# Altium project Fast_Servo.PrjPCB (part 4 of 7)

## Sheet CON_MEZZANINE_ANALOG.SchDoc: Mezzanine con analog
size 420 x 297 mm; Author: G.Kasprowicz; CompanyName: WUT ISE; DrawnBy: G.Kasprowicz; Organization: WUT ISE; Address1: PW ISE; Address2: Nowowiejska 15/19 00-665 Warsaw; Address3: gkasprow@gmail.com; DocumentNumber: 21; Revision: 1.0; SheetNumber: 21; SheetTotal: 37; ModifiedBy: -; CheckedDate: -; DivGrp: WUT ISE; Designer: G.Kasprowicz; Title2: Fast Stabilizer; ModifiedDate: -; ProjectName: Sensor Box
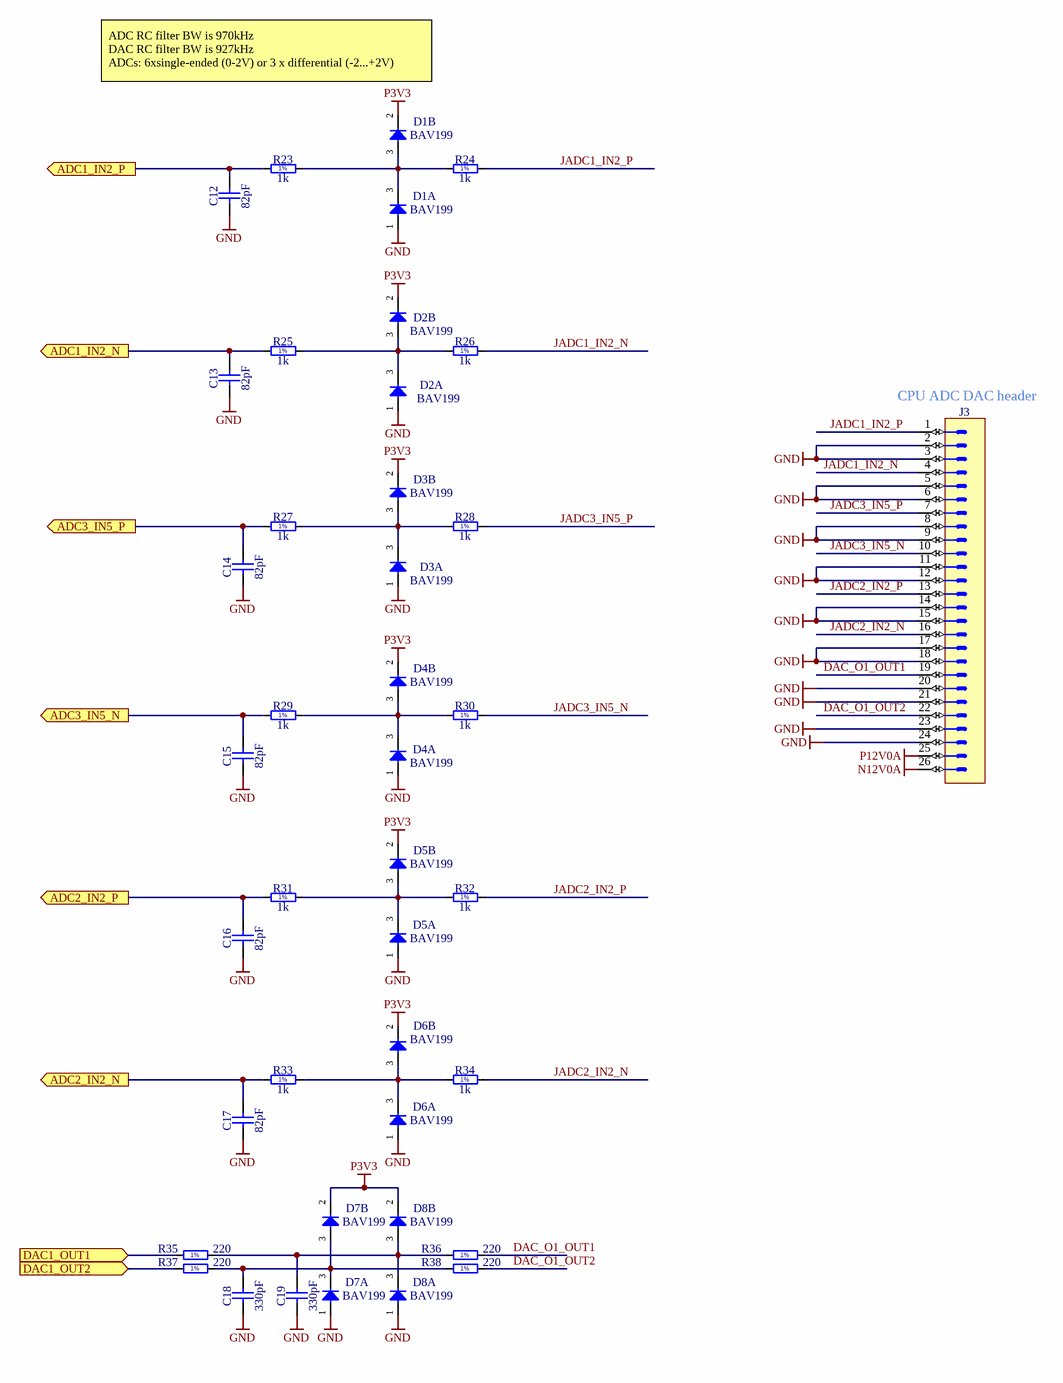
[diagram p14: CON_MEZZANINE_ANALOG.SchDoc]

### Parts
C12  82pF  [CAPC1608X87N]
C13  82pF  [CAPC1608X87N]
C14  82pF  [CAPC1608X87N]
C15  82pF  [CAPC1608X87N]
C16  82pF  [CAPC1608X87N]
C17  82pF  [CAPC1608X87N]
C18  330pF  [CAPC1608X87N]
C19  330pF  [CAPC1608X87N]
D1  BAV199  [SOT95P240X110-3N]  (parts A,B of 2)
D2  BAV199  [SOT95P240X110-3N]  (parts A,B of 2)
D3  BAV199  [SOT95P240X110-3N]  (parts A,B of 2)
D4  BAV199  [SOT95P240X110-3N]  (parts A,B of 2)
D5  BAV199  [SOT95P240X110-3N]  (parts A,B of 2)
D6  BAV199  [SOT95P240X110-3N]  (parts A,B of 2)
D7  BAV199  [SOT95P240X110-3N]  (parts A,B of 2)
D8  BAV199  [SOT95P240X110-3N]  (parts A,B of 2)
J3  Header 26  [3M_N2526-6002RB]  (value not drawn)
R23  1k  [RESC1005X40N]
R24  1k  [RESC1005X40N]
R25  1k  [RESC1005X40N]
R26  1k  [RESC1005X40N]
R27  1k  [RESC1005X40N]
R28  1k  [RESC1005X40N]
R29  1k  [RESC1005X40N]
R30  1k  [RESC1005X40N]
R31  1k  [RESC1005X40N]
R32  1k  [RESC1005X40N]
R33  1k  [RESC1005X40N]
R34  1k  [RESC1005X40N]
R35  220  [RESC1608X55N]
R36  220  [RESC1608X55N]
R37  220  [RESC1608X55N]
R38  220  [RESC1608X55N]

### Ports
ADC1_IN2_N (out), ADC1_IN2_P (out), ADC2_IN2_N (out), ADC2_IN2_P (out), ADC3_IN5_N (out), ADC3_IN5_P (out), DAC1_OUT1 (in), DAC1_OUT2 (in)

### Nets
GND: C12.1 C13.1 C14.1 C15.1 C16.1 C17.1 C18.1 C19.1 D1.1(A) D2.1(A) D3.1(A) D4.1(A) D5.1(A) D6.1(A) D7.1(A) D8.1(A) J3.2 J3.3 J3.5 J3.6 J3.8 J3.9 J3.11 J3.12 J3.14 J3.15 J3.17 J3.18 J3.20 J3.21 J3.23 J3.24
N12V0A: J3.26
P3V3: D1.2(C) D2.2(C) D3.2(C) D4.2(C) D5.2(C) D6.2(C) D7.2(C) D8.2(C)
P12V0A: J3.25
ADC_AUX_CH1_N: C13.2 R25.1 ; port ADC1_IN2_N
ADC_AUX_CH1_P: C12.2 R23.1 ; port ADC1_IN2_P
ADC_AUX_CH2_N: C17.2 R33.1 ; port ADC2_IN2_N
ADC_AUX_CH2_P: C16.2 R31.1 ; port ADC2_IN2_P
ADC_AUX_CH3_N: C15.2 R29.1 ; port ADC3_IN5_N
ADC_AUX_CH3_P: C14.2 R27.1 ; port ADC3_IN5_P
DAC_O1_OUT1: J3.19 R36.2
DAC_O1_OUT2: J3.22 R38.2
JADC1_IN2_N: J3.4 R26.2
JADC1_IN2_P: J3.1 R24.2
JADC2_IN2_N: J3.16 R34.2
JADC2_IN2_P: J3.13 R32.2
JADC3_IN5_N: J3.10 R30.2
JADC3_IN5_P: J3.7 R28.2
VOUTA: R35.1 ; port DAC1_OUT1
VOUTB: R37.1 ; port DAC1_OUT2
NetC18_2: C18.2 D7.3(COMAC) R37.2 R38.1
NetC19_2: C19.2 D8.3(COMAC) R35.2 R36.1
NetD1_3: D1.3(COMAC) R23.2 R24.1
NetD2_3: D2.3(COMAC) R25.2 R26.1
NetD3_3: D3.3(COMAC) R27.2 R28.1
NetD4_3: D4.3(COMAC) R29.2 R30.1
NetD5_3: D5.3(COMAC) R31.2 R32.1
NetD6_3: D6.3(COMAC) R33.2 R34.1

### Notes on the sheet
- (near D1) ADC RC filter BW is 970kHz
  DAC RC filter BW is 927kHz
  ADCs: 6xsingle-ended (0-2V) or 3 x differential (-2...+2V)
- (near J3) CPU ADC DAC header
- Project/Equipment
- Document
- Designer
- Drawn by
- Check.by
- Copyright WUT ISE 2020.
  This documentation describes Open Hardware and is licensed under the CERN OHL v.1.2. You may redistribute and modify this documentation under the terms of the CERN OHL v.1.2. (http://ohwr.org/CERNOHL). This documentation is distributed WITHOUT ANY EXPRESS OR IMPLIED WARRANTY, INCLUDING OF MERCHANTABILITY, SATISFACTORY QUALITY AND FITNESS FOR A PARTICULAR PURPOSE. Please see the CERN OHL v.1.2 for applicable conditions.
- Contact
- File
- Last Mod.
- Print Date
- Sheet
- Size
- A3
- of
- Rev
- (in symbol R0402_1K_1%_0.0625W_100PPM) 1%
- (in symbol R0603_220R_1%_0.1W_100PPM) 1%

### Library data of the parts
C12-C17 = CC0603_82PF_50V_5%_NP0: Non-polarised capacitor; Part Description: SMD Multilayer Chip Ceramic Capacitor; Manufacturer: GENERIC; Manufacturer1 Part Number: 223886715829; Voltage: 50V; TC: C0G/NP0; Tolerance: ±5%; Part Number: CC0603_82PF_50V_5%_NP0; Component Kind: Standard; Component Type: Standard; Pin Count: 2; Value: 82pF; Status: Preferred; Manufacturer Part Number: CC0603_82PF_50V_5%_NP0; Case: 0603; Mounted: Yes; Socket: No; SMD: Yes; Sense: No; Manufacturer1 Example: PHYCOMP; Manufacturer1 ComponentHeight: 0.87mm; HelpURL: \\cern.ch\dfs\Applications\Altium\Datasheets\CC0603_NP0_PHYCOMP.pdf; Author: CERN DEM JLC; CreateDate: 03.12.2007; LatestRevisionDate: 03.12.2007
C18 C19 = CC0603_330PF_50V_1%_NP0: Non-polarised capacitor; Part Description: SMD Multilayer Chip Ceramic Capacitor; Manufacturer: GENERIC; Manufacturer1 Part Number: 223886718331; Voltage: 50V; TC: C0G/NP0; Tolerance: ±1%; Part Number: CC0603_330PF_50V_1%_NP0; Component Kind: Standard; Component Type: Standard; Pin Count: 2; Value: 330pF; Status: None; Manufacturer Part Number: CC0603_330PF_50V_1%_NP0; Case: 0603; Mounted: Yes; Socket: No; SMD: Yes; Sense: No; Manufacturer1 Example: PHYCOMP; Manufacturer1 ComponentHeight: 0.87mm; HelpURL: \\cern.ch\dfs\Applications\Altium\Datasheets\CC0603_NP0_PHYCOMP.pdf; Author: CERN DEM MR; CreateDate: 06.09.2017; LatestRevisionDate: 06.09.2017
D1-D8 = BAV199: Serial Diode; Part Description: Low-Leakage Double Diode; Manufacturer: NXP SEMICONDUCTORS; Voltage: 75V; Power: 250mW; PressFit: No; Bonding: No; Part Number: BAV199; Component Kind: Standard; Component Type: Standard; Device: BAV199; PackageDescription: SOT23 3-Leads, Pitch 0.95mm - Body 1.4x3mm, IPC Medium Density; Manufacturer Part Number: BAV199; Pin Count: 3; Case: SOT23-3; Mounted: Yes; Socket: No; SMD: Yes; Sense: No; ComponentHeight: 1.1mm; HelpURL: \\cern.ch\dfs\Applications\Altium\Datasheets\BAV199.pdf; Author: CERN DEM JMW; CreateDate: 2008-11-21; LatestRevisionDate: 2008-11-21
J3 = 3M_N2526-6002RB: Connector 26 Male; Part Description: 26 Contacts - Straight .100'' x .100'' Low Profile Four-Wall Header, 2500 Series; Manufacturer: 3M; PressFit: No; Part Number: 3M_N2526-6002RB; Component Kind: Standard; Component Type: Standard; Pin Count: 26; Family: Header 26; Mounted: Yes; Socket: No; SMD: No; Sense: No; Status: None; Manufacturer Part Number: N2526-6002RB; ComponentHeight: 10.03mm; HelpURL: \\cern.ch\dfs\Applications\Altium\Datasheets\3M_N2526-6002RB.pdf; Author: CERN DEM JLC; CreateDate: 11.02.2009; LatestRevisionDate: 11.08.2009
R23-R34 = R0402_1K_1%_0.0625W_100PPM: as R133 on sheet EEPROM_Sensors; Part Number: R0402_1K_1%_0.0625W_100PPM; Component Kind: Standard; Component Type: Standard; Pin Count: 2; Value: 1k; Status: Not Recommended; Power: 0.0625W; Tolerance: ±1%; Manufacturer Part Number: R0402_1K_1%_0.0625W_100PPM; Case: 0402; Mounted: Yes; Sense: No; Socket: No; SMD: Yes; Manufacturer1 Example: YAGEO PHYCOMP; Manufacturer1 ComponentHeight: 0.4mm; HelpURL: \\cern.ch\dfs\Applications\Altium\Datasheets\R0402_Phycomp_RC0402.pdf; Author: CERN DEM JLC; CreateDate: 03/12/2007; LatestRevisionDate: 17/10/2012
R35-R38 = R0603_220R_1%_0.1W_100PPM: Resistor - 1%; Part Description: General Purpose Thick Film Chip Resistor; Manufacturer: GENERIC; Manufacturer1 Part Number: NRC06F2200TRF; Power: 0.1W; TC: ±100ppm/°C; PressFit: No; Part Number: R0603_220R_1%_0.1W_100PPM; Component Kind: Standard; Component Type: Standard; Pin Count: 2; Value: 220; Status: Preferred; Tolerance: ±1%; Manufacturer Part Number: R0603_220R_1%_0.1W_100PPM; Case: 0603; Mounted: Yes; Sense: No; Socket: No; SMD: Yes; Manufacturer1 Example: NIC COMPONENT; Manufacturer1 ComponentHeight: 0.55mm; HelpURL: \\cern.ch\dfs\Applications\Altium\Datasheets\R0603_NIC_NRC.pdf; Author: CERN DEM JLC; CreateDate: 03/12/2007; LatestRevisionDate: 13/03/2008

## Sheet ADC_AUX.SchDoc: Auxillary ADC
size 420 x 297 mm; Author: P. Zdunek; DrawnBy: P. Zdunek; Organization: Altium Limited; Address1: L3, 12a Rodborough Rd; Address2: Frenchs Forest; Address3: NSW; Address4: Australia 2086; DocumentNumber: 10; SheetNumber: 10; SheetTotal: 37; ModifiedBy: -; CheckedDate: -; Title2: Fast Stabilizer; DivGrp: WUT ISE; Designer: G.Kasprowicz
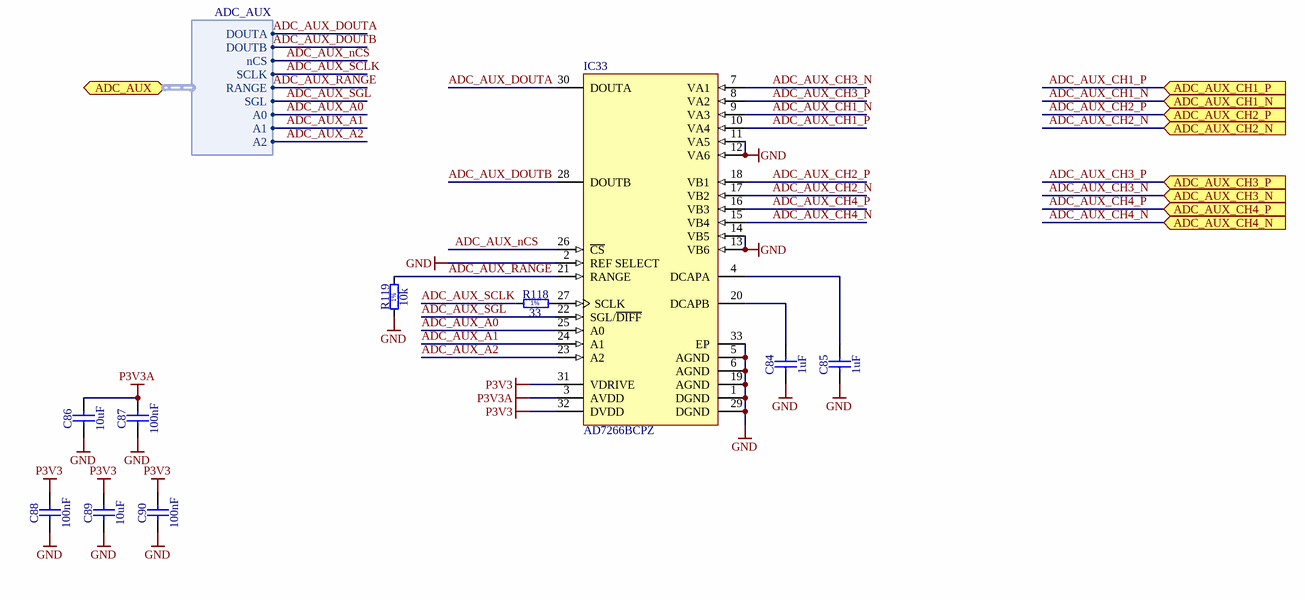
[diagram p15: ADC_AUX.SchDoc]

### Parts
C84  1uF  [CAPC1005X55N]
C85  1uF  [CAPC1005X55N]
C86  10uF  [CAPC1608X80N]
C87  100nF  [CAPC1005X55N]
C88  100nF  [CAPC1005X55N]
C89  10uF  [CAPC1608X80N]
C90  100nF  [CAPC1005X55N]
IC33  AD7266BCPZ  [CP-32-2_N]
R118  33  [RESC1005X40N]
R119  10k  [RESC1005X40N]

### Ports
ADC_AUX (bidir, harness ADC_AUX), ADC_AUX_CH1_N (in), ADC_AUX_CH1_P (in), ADC_AUX_CH2_N (in), ADC_AUX_CH2_P (in), ADC_AUX_CH3_N (in), ADC_AUX_CH3_P (in), ADC_AUX_CH4_N (in), ADC_AUX_CH4_P (in)

### Harnesses
ADC_AUX: DOUTA, DOUTB, nCS, RANGE, SCLK, SGL, A0, A1, A2

### Nets
GND: C84.1 C85.1 C86.1 C87.1 C88.1 C89.1 C90.1 IC33.1(DGND) IC33.2(REF_SELECT) IC33.5(AGND) IC33.6(AGND) IC33.11(VA5) IC33.12(VA6) IC33.13(VB6) IC33.14(VB5) IC33.19(AGND) IC33.29(DGND) IC33.33(EP) R119.1
P3V3: C88.2 C89.2 C90.2 IC33.31(VDRIVE) IC33.32(DVDD)
P3V3A: C86.2 C87.2 IC33.3(AVDD)
ADC_AUX_A0: IC33.25(A0) ; port ADC_AUX.A0
ADC_AUX_A1: IC33.24(A1) ; port ADC_AUX.A1
ADC_AUX_A2: IC33.23(A2) ; port ADC_AUX.A2
ADC_AUX_CH1_N: IC33.9(VA3) ; port ADC_AUX_CH1_N
ADC_AUX_CH1_P: IC33.10(VA4) ; port ADC_AUX_CH1_P
ADC_AUX_CH2_N: IC33.17(VB2) ; port ADC_AUX_CH2_N
ADC_AUX_CH2_P: IC33.18(VB1) ; port ADC_AUX_CH2_P
ADC_AUX_CH3_N: IC33.7(VA1) ; port ADC_AUX_CH3_N
ADC_AUX_CH3_P: IC33.8(VA2) ; port ADC_AUX_CH3_P
ADC_AUX_CH4_N: IC33.15(VB4) ; port ADC_AUX_CH4_N  [project net ADC_AUX_N]
ADC_AUX_CH4_P: IC33.16(VB3) ; port ADC_AUX_CH4_P  [project net ADC_AUX_P]
ADC_AUX_DOUTA: IC33.30(DOUTA) ; port ADC_AUX.DOUTA
ADC_AUX_DOUTB: IC33.28(DOUTB) ; port ADC_AUX.DOUTB
ADC_AUX_nCS: IC33.26(~{CS}) ; port ADC_AUX.nCS
ADC_AUX_RANGE: IC33.21(RANGE) R119.2 ; port ADC_AUX.RANGE
ADC_AUX_SCLK: R118.1 ; port ADC_AUX.SCLK
ADC_AUX_SGL: IC33.22(SGL/~{DIFF}) ; port ADC_AUX.SGL
NetC84_2: C84.2 IC33.20(DCAPB)
NetC85_2: C85.2 IC33.4(DCAPA)
NetIC33_27: IC33.27(SCLK) R118.2

### Notes on the sheet
- Project/Equipment
- Document
- Designer
- Drawn by
- Check.by
- Copyright WUT ISE 2020.
  This documentation describes Open Hardware and is licensed under the CERN OHL v.1.2. You may redistribute and modify this documentation under the terms of the CERN OHL v.1.2. (http://ohwr.org/CERNOHL). This documentation is distributed WITHOUT ANY EXPRESS OR IMPLIED WARRANTY, INCLUDING OF MERCHANTABILITY, SATISFACTORY QUALITY AND FITNESS FOR A PARTICULAR PURPOSE. Please see the CERN OHL v.1.2 for applicable conditions.
- Contact
- File
- Last Mod.
- Print Date
- Sheet
- Size
- A3
- of
- Rev
- (in symbol R0402_10K_1%_0.0625W_100PPM) 1%
- (in symbol R0402_33R_1%_0.0625W_100PPM) 1%

### Library data of the parts
C84 C85 = CC0402_1UF_16V_10%_X5R: Non-polarised capacitor; Part Description: SMD Multilayer Chip Ceramic Capacitor; Manufacturer: GENERIC; Manufacturer1 Part Number: C1005X5R1C105KT; Voltage: 16V; TC: X5R; Tolerance: ±10%; Part Number: CC0402_1UF_16V_10%_X5R; Component Kind: Standard; Component Type: Standard; Pin Count: 2; Value: 1uF; Status: Preferred; Manufacturer Part Number: CC0402_1UF_16V_10%_X5R; Case: 0402; Mounted: Yes; Socket: No; SMD: Yes; Sense: No; Manufacturer1 Example: TDK; Manufacturer1 ComponentHeight: 0.55mm; HelpURL: \\cern.ch\dfs\Applications\Altium\Datasheets\CC0402_X5R_TDK_C.pdf; Author: CERN DEM JLC; CreateDate: 25.10.2012; LatestRevisionDate: 25.10.2012
C86 C89 = CC0603_10UF_10V_10%_X5R: Non-polarised capacitor; Part Description: SMD Multilayer Chip Ceramic Capacitor; Manufacturer: GENERIC; Manufacturer1 Part Number: GRM188R61A106KE69D; Voltage: 10V; TC: X5R; Tolerance: ±10%; Part Number: CC0603_10UF_10V_10%_X5R; Component Kind: Standard; Component Type: Standard; Pin Count: 2; Value: 10uF; Status: None; Manufacturer Part Number: CC0603_10UF_10V_10%_X5R; Case: 0603; Mounted: Yes; Socket: No; SMD: Yes; Sense: No; Manufacturer1 Example: MURATA; Manufacturer1 ComponentHeight: 0.8mm; HelpURL: \\cern.ch\dfs\Applications\Altium\Datasheets\CC0603_MURATA_GRM188R61A106KE69D.pdf; Author: CERN DEM JLC; CreateDate: 31-Jan-17; LatestRevisionDate: 31-Jan-17
C87 C88 C90 = CC0402_100NF_16V_10%_X7R: Non-polarised capacitor; Part Description: SMD Multilayer Chip Ceramic Capacitor; Manufacturer: GENERIC; Manufacturer1 Part Number: GRM155R71C104KA88D; Voltage: 16V; TC: X7R; Tolerance: ±10%; Part Number: CC0402_100NF_16V_10%_X7R; Component Kind: Standard; Component Type: Standard; Pin Count: 2; Value: 100nF; Status: Not Recommended; Manufacturer Part Number: CC0402_100NF_16V_10%_X7R; Case: 0402; Mounted: Yes; Socket: No; SMD: Yes; Sense: No; Manufacturer1 Example: MURATA; Manufacturer1 ComponentHeight: 0.55mm; HelpURL: \\cern.ch\dfs\Applications\Altium\Datasheets\CC0402_X7R_MURATA_GRM.pdf; Author: CERN DEM JLC; CreateDate: 05-Dec-13; LatestRevisionDate: 03-Dec-07
IC33 = CMP-0313-00285-2: 1Dual 12-Bit SAR Analog-to-Digital Converter with Serial, SPI Interface, 2MSPS, -40 to +125 degC, CP-32-2, Pb-Free, Tray; Manufacturer: Analog Devices; Generic Part Number: AD7266; Throughput Rate (SPS): 2M; Interface: Ser, SPI; Resolution (Bits): 12; DatasheetVersion: Rev.B; ComponentLink1Description: Manufacturer URL; RoHS: Y; ComponentLink4Description: Product URL; ComponentLink2URL: http://www.analog.com/static/imported-files/data_sheets/AD7266.pdf; Channels: 12; PartNumber: AD7266BCPZ; ComponentLink2Description: Datasheet; Code_JEDEC: MO-220-VHHD-2; PackageReference: CP-32-2; Packing: Tray; ComponentLink3URL: http://www.analog.com/static/imported-files/packages/414143737956480539664569CP_32_2.pdf; PackageVersion: Jan-2005; ComponentLink4URL: http://www.analog.com/en/analog-to-digital-converters/ad-converters/ad7266/products/product.html; Mounting Technology: Surface Mount; PackageDescription: 32-Lead Lead Frame Chip Scale Package [LFCSP_VQ] 5 x 5 mm Body, Very Thin Quad; ComponentLink1URL: http://www.analog.com/en/index.html; ComponentLink3Description: Package Specification
R118 = R0402_33R_1%_0.0625W_100PPM: Resistor - 1%; Part Description: General Purpose Thick Film Chip Resistor; Manufacturer: GENERIC; Manufacturer1 Part Number: 232270673309L; PressFit: No; TC: ±100ppm/°C; Part Number: R0402_33R_1%_0.0625W_100PPM; Component Kind: Standard; Component Type: Standard; Pin Count: 2; Value: 33; Status: Not Recommended; Manufacturer Part Number: R0402_33R_1%_0.0625W_100PPM; Case: 0402; Mounted: Yes; Sense: No; Socket: No; SMD: Yes; Manufacturer1 Example: YAGEO PHYCOMP; Manufacturer1 ComponentHeight: 0.4mm; HelpURL: \\cern.ch\dfs\Applications\Altium\Datasheets\R0402_Phycomp_RC0402.pdf; Author: CERN DEM JLC; CreateDate: 03-Dec-07; LatestRevisionDate: 17-Oct-12; Power: 0.0625W; Tolerance: ±1%
R119 = R0402_10K_1%_0.0625W_100PPM: Resistor - 1%; Part Description: General Purpose Thick Film Chip Resistor; Manufacturer: GENERIC; Manufacturer1 Part Number: 232270671003L; PressFit: No; TC: ±100ppm/°C; Part Number: R0402_10K_1%_0.0625W_100PPM; Component Kind: Standard; Component Type: Standard; Pin Count: 2; Value: 10k; Status: Not Recommended; Manufacturer Part Number: R0402_10K_1%_0.0625W_100PPM; Case: 0402; Mounted: Yes; Sense: No; Socket: No; SMD: Yes; Manufacturer1 Example: YAGEO PHYCOMP; Manufacturer1 ComponentHeight: 0.4mm; HelpURL: \\cern.ch\dfs\Applications\Altium\Datasheets\R0402_Phycomp_RC0402.pdf; Author: CERN DEM JLC; CreateDate: 03-Dec-07; LatestRevisionDate: 17-Oct-12; Power: 0.0625W; Tolerance: ±1%

## Sheet CLK_GEN.SchDoc: Clock generation
size 420 x 297 mm; Author: P. Zdunek; DrawnBy: P. Zdunek; DocumentNumber: 17; SheetNumber: 17; SheetTotal: 37; ModifiedBy: -; CheckedDate: -; Title2: Fast Stabilizer; DivGrp: WUT ISE; Designer: G.Kasprowicz
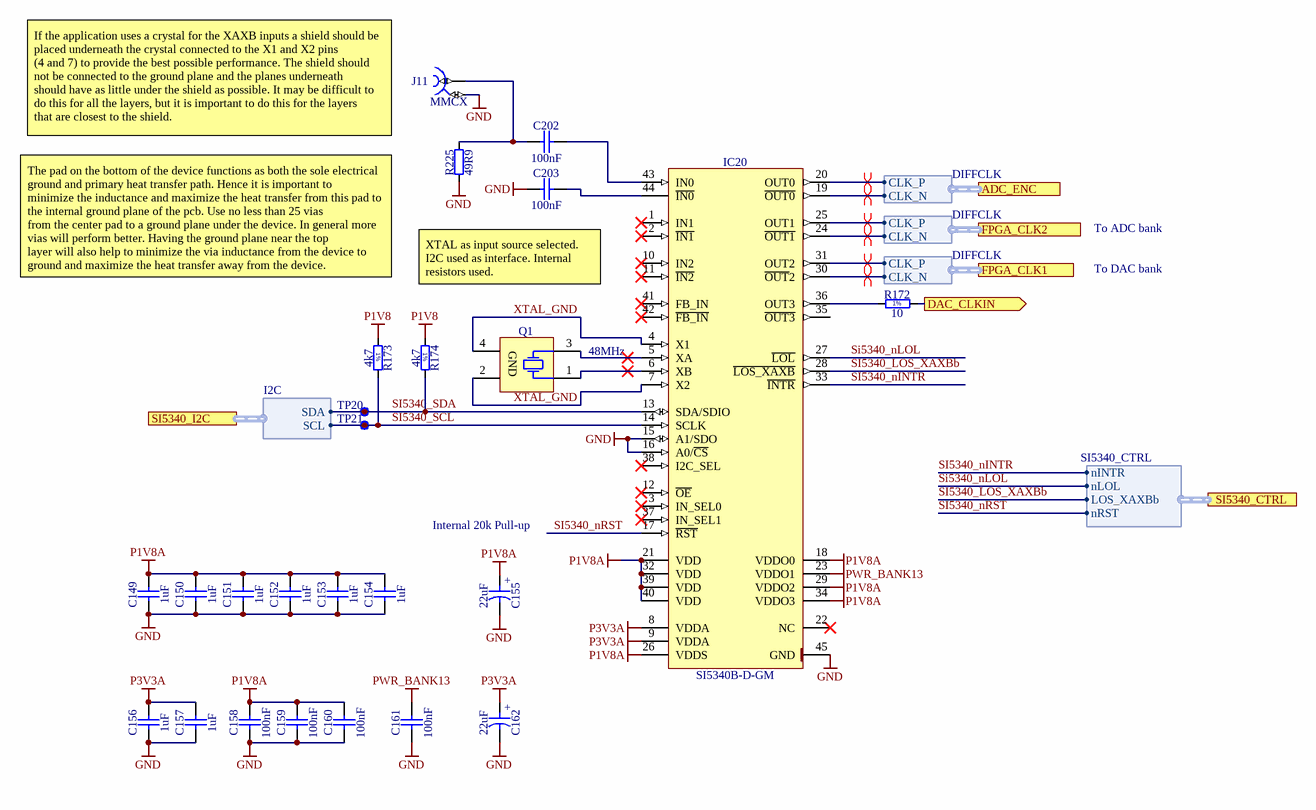
[diagram p16: CLK_GEN.SchDoc]

### Parts
C149  1uF  [CAPC1005X55N]
C150  1uF  [CAPC1005X55N]
C151  1uF  [CAPC1005X55N]
C152  1uF  [CAPC1005X55N]
C153  1uF  [CAPC1005X55N]
C154  1uF  [CAPC1005X55N]
C155  22uF  [CAPMP3216X180N]
C156  1uF  [CAPC1005X55N]
C157  1uF  [CAPC1005X55N]
C158  100nF  [CAPC1005X55N]
C159  100nF  [CAPC1005X55N]
C160  100nF  [CAPC1005X55N]
C161  100nF  [CAPC1005X55N]
C162  22uF  [CAPMP3216X180N]
C202  100nF  [CAPC1005X55N]
C203  100nF  [CAPC1005X55N]
IC20  SI5340B-D-GM  [QFN50P700X700X90-45N-S530]
J11  MMCX  [SAMTEC_MMCX-J-P-H-ST-TH1]
Q1  48MHz  [XTAL_TXC_7M]
R172  10  [RESC1005X40N]
R173  4k7  [RESC1005X40N]
R174  4k7  [RESC1005X40N]
R225  49R9  [RESC1005X40N]
TP20  SMD Pad  [C100]  (value not drawn)  (no BOM)
TP21  SMD Pad  [C100]  (value not drawn)  (no BOM)

### Ports
ADC_ENC (harness DIFFCLK), DAC_CLKIN (out), FPGA_CLK1 (harness DIFFCLK), FPGA_CLK2 (harness DIFFCLK), SI5340_CTRL (harness SI5340_CTRL), SI5340_I2C (harness I2C)

### Harnesses
SI5340_CTRL: nINTR, nLOL, LOS_XAXBb, nRST
I2C: SDA, SCL
DIFFCLK: CLK_P, CLK_N

### Nets
GND: C149.1 C150.1 C151.1 C152.1 C153.1 C154.1 C155.2 C156.1 C157.1 C158.1 C159.1 C160.1 C161.1 C162.2 C203.1 IC20.15(A1/SDO) IC20.16(A0/~{CS}) IC20.45(GND) J11.2 R225.1
P1V8: R173.1 R174.1
P1V8A: C149.2 C150.2 C151.2 C152.2 C153.2 C154.2 C155.1 C158.2 C159.2 C160.2 IC20.18(VDDO0) IC20.21(VDD) IC20.26(VDDS) IC20.29(VDDO2) IC20.32(VDD) IC20.34(VDDO3) IC20.39(VDD) IC20.40(VDD)
P3V3A: C156.2 C157.2 C162.1 IC20.8(VDDA) IC20.9(VDDA)
PWR_BANK13: C161.2 IC20.23(VDDO1)
CLK2_N: IC20.24(~{OUT1}) ; port FPGA_CLK2.CLK_N
CLK2_P: IC20.25(OUT1) ; port FPGA_CLK2.CLK_P
DAC_CLKIN: R172.2 ; port DAC_CLKIN
ENC_N: IC20.19(~{OUT0}) ; port ADC_ENC.CLK_N
ENC_P: IC20.20(OUT0) ; port ADC_ENC.CLK_P
SI5340_LOS_XAXBb: IC20.28(~{LOS_XAXB}) ; port SI5340_CTRL.LOS_XAXBb
SI5340_nINTR: IC20.33(~{INTR}) ; port SI5340_CTRL.nINTR
Si5340_nLOL: IC20.27(~{LOL}) ; port SI5340_CTRL.nLOL
SI5340_nRST: IC20.17(~{RST}) ; port SI5340_CTRL.nRST
SI5340_SCL: IC20.14(SCLK) R173.2 TP21.1 ; port SI5340_I2C.SCL
SI5340_SDA: IC20.13(SDA/SDIO) R174.2 TP20.1 ; port SI5340_I2C.SDA
XTAL_GND: IC20.4(X1) IC20.7(X2) Q1.2(GND) Q1.4(GND)
NetC202_1: C202.1 J11.1 R225.2
NetC202_2: C202.2 IC20.43(IN0)
NetC203_2: C203.2 IC20.44(~{IN0})
NetIC20_5: IC20.5(XA) Q1.3(X)
NetIC20_6: IC20.6(XB) Q1.1(X)
NetIC20_30: IC20.30(~{OUT}2) ; port FPGA_CLK1.CLK_N
NetIC20_31: IC20.31(OUT2) ; port FPGA_CLK1.CLK_P
NetIC20_36: IC20.36(OUT3) R172.1

Not connected (* = marked no-connect by the designer): IC20 1(IN1)* 2(~{IN1})* 3(IN_SEL0)* 10(IN2)* 11(~{IN2})* 12(~{OE})* 22(NC)* 35(~{OUT3}) 37(IN_SEL1)* 38(I2C_SEL)* 41(FB_IN)* 42(~{FB_IN})*

### Layout directives
differential pair: CLK2_N, CLK2_P, ENC_N, ENC_P, NetIC20_30, NetIC20_31

### Notes on the sheet
- If the application uses a crystal for the XAXB inputs a shield should be placed underneath the crystal connected to the X1 and X2 pins
  (4 and 7) to provide the best possible performance. The shield should not be connected to the ground plane and the planes underneath
  should have as little under the shield as possible. It may be difficult to do this for all the layers, but it is important to do this for the layers
  that are closest to the shield.
- To ADC bank
- The pad on the bottom of the device functions as both the sole electrical ground and primary heat transfer path. Hence it is important to
  minimize the inductance and maximize the heat transfer from this pad to the internal ground plane of the pcb. Use no less than 25 vias
  from the center pad to a ground plane under the device. In general more vias will perform better. Having the ground plane near the top
  layer will also help to minimize the via inductance from the device to ground and maximize the heat transfer away from the device.
- XTAL as input source selected. I2C used as interface. Internal resistors used.
- To DAC bank
- Internal 20k Pull-up
- Project/Equipment
- Document
- Designer
- Drawn by
- Check.by
- Copyright WUT ISE 2020.
  This documentation describes Open Hardware and is licensed under the CERN OHL v.1.2. You may redistribute and modify this documentation under the terms of the CERN OHL v.1.2. (http://ohwr.org/CERNOHL). This documentation is distributed WITHOUT ANY EXPRESS OR IMPLIED WARRANTY, INCLUDING OF MERCHANTABILITY, SATISFACTORY QUALITY AND FITNESS FOR A PARTICULAR PURPOSE. Please see the CERN OHL v.1.2 for applicable conditions.
- Contact
- File
- Last Mod.
- Print Date
- Sheet
- Size
- A3
- of
- Rev
- (in symbol CTE3216-18_22UF_10V_10%) +
- (in symbol R0402_4K7_1%_0.0625W_100PPM) 1%
- (in symbol R0402_10R_1%_0.0625W_200PPM) 1%

### Library data of the parts
C149-C154 C156 C157 = CC0402_1UF_16V_10%_X5R: as C84 on sheet ADC_AUX; Part Number: CC0402_1UF_16V_10%_X5R; Component Kind: Standard; Component Type: Standard; Pin Count: 2; Value: 1uF; Status: Preferred; Manufacturer Part Number: CC0402_1UF_16V_10%_X5R; Case: 0402; Mounted: Yes; Socket: No; SMD: Yes; Sense: No; Manufacturer1 Example: TDK; Manufacturer1 ComponentHeight: 0.55mm; HelpURL: \\cern.ch\dfs\Applications\Altium\Datasheets\CC0402_X5R_TDK_C.pdf; Author: CERN DEM JLC; CreateDate: 25-Oct-12; LatestRevisionDate: 25-Oct-12
C155 C162 = CTE3216-18_22UF_10V_10%: Polarised capacitor; Part Description: Solid Tantalum Chip Capacitor; Manufacturer: GENERIC; Manufacturer1 Part Number: TAJA226K010R; Voltage: 10V; Tolerance: ±10%; Part Number: CTE3216-18_22UF_10V_10%; Component Kind: Standard; Component Type: Standard; Pin Count: 2; Value: 22uF; Status: Preferred; Manufacturer Part Number: CTE3216-18_22UF_10V_10%; Case: A; Mounted: Yes; Socket: No; SMD: Yes; Sense: No; Manufacturer1 Example: AVX; Manufacturer1 ComponentHeight: 1.8mm; HelpURL: \\cern.ch\dfs\Applications\Altium\Datasheets\CTE_AVX_TAJ.pdf; Author: CERN DEM JLC; CreateDate: 03.12.2007; LatestRevisionDate: 03.12.2007
C158-C161 C202 C203 = CC0402_100NF_16V_10%_X5R: Non-polarised capacitor; Part Description: SMD Multilayer Chip Ceramic Capacitor; Manufacturer: GENERIC; Manufacturer1 Part Number: GRM155R61C104KA88D; Voltage: 16V; TC: X5R; Tolerance: ±10%; Part Number: CC0402_100NF_16V_10%_X5R; Component Kind: Standard; Component Type: Standard; Pin Count: 2; Value: 100nF; Status: None; Manufacturer Part Number: CC0402_100NF_16V_10%_X5R; Case: 0402; Mounted: Yes; Socket: No; SMD: Yes; Sense: No; Manufacturer1 Example: MURATA; Manufacturer1 ComponentHeight: 0.55mm; HelpURL: \\cern.ch\dfs\Applications\Altium\Datasheets\CC0402_X5R_MURATA_GRM.pdf; Author: CERN DEM JLC; CreateDate: 10/12/2013; LatestRevisionDate: 10/12/2013
IC20 = SI5340B-D-GM: Low-Jitter, 10 or 4-Output, Any-Frequency, Any-Output Clock Generator; Manufacturer: SILICON LABS; PressFit: No; Bonding: No; Part Number: SI5340B-D-GM; Component Kind: Standard; Component Type: Standard; Device: SI5340B-D-GM; PackageDescription: QFN,0.50mm Pitch, Square; 44 Pin, 7.00mm L X 7.00mm W X 0.90mm H Body (W/Thermal Tab 5.3mm X 5.3mm), IPC Medium Density; Part Description: Low-Jitter, 10 or 4-Output, Any-Frequency, Any-Output Clock Generator; Manufacturer Part Number: SI5340B-D-GM; Pin Count: 45; Case: QFN44; Mounted: Yes; Socket: No; SMD: Yes; Sense: No; ComponentHeight: 0.9mm; Author: CERN DEM JLC; HelpURL: \\cern.ch\dfs\Applications\Altium\Datasheets\SI5340B-D-GM.pdf; CreateDate: 14-Dec-17; LatestRevisionDate: 14-Dec-17
J11 = SAMTEC_MMCX-J-P-H-ST-TH1: Part Description: Straight Through-hole 50 Ohm Micro Mini RF Jack, MMCX Series; Manufacturer: SAMTEC; PressFit: No; Part Number: SAMTEC_MMCX-J-P-H-ST-TH1; Component Kind: Standard; Component Type: Standard; Pin Count: 2; Mounted: Yes; Socket: No; SMD: No; Sense: No; Status: None; Manufacturer Part Number: MMCX-J-P-H-ST-TH1; ComponentHeight: 4.35mm; HelpURL: \\cern.ch\dfs\Applications\Altium\Datasheets\SAMTEC_MMCX-J-P-H-ST-TH1.pdf; Author: CERN DEM JLC; CreateDate: 05.12.2012; LatestRevisionDate: 05.12.2012
Q1 = XTAL_48MHZ_TXC_7M-48.000MAHV: Crystal 4 pins 1=XTAL Control 2=GND3=XTAL 4=GND; Part Description: ±30ppm 8pF -40°C to +85°C  4 Pins, 3.2x2.5X0.8mm, SMD Sealing Crystal, 7M Series; Manufacturer: TXC CORPORATION; PressFit: No; Bonding: No; Part Number: XTAL_48MHZ_TXC_7M-48.000MAHV; Component Kind: Standard; Component Type: Standard; PackageDescription: 4 Pins, 2.5x3.2mm, SMD Sealing Crystal, 7M Serie; Value: 48MHz; Manufacturer Part Number: 7M-48.000MAHV; Pin Count: 4; Mounted: Yes; Socket: No; SMD: Yes; Sense: No; ComponentHeight: 0.8mm; HelpURL: \\cern.ch\dfs\Applications\Altium\Datasheets\XTAL_TXC_7M.pdf; Author: CERN DEM MR; CreateDate: 30-May-16; LatestRevisionDate: 30-May-16
R172 = R0402_10R_1%_0.0625W_200PPM: Resistor - 1%; Part Description: General Purpose Thick Film Chip Resistor; Manufacturer: GENERIC; Manufacturer1 Part Number: 232270671009L; TC: ±200ppm/°C; PressFit: No; Part Number: R0402_10R_1%_0.0625W_200PPM; Component Kind: Standard; Component Type: Standard; Pin Count: 2; Value: 10; Status: Not Recommended; Power: 0.0625W; Tolerance: ±1%; Manufacturer Part Number: R0402_10R_1%_0.0625W_200PPM; Case: 0402; Mounted: Yes; Sense: No; Socket: No; SMD: Yes; Manufacturer1 Example: YAGEO PHYCOMP; Manufacturer1 ComponentHeight: 0.4mm; HelpURL: \\cern.ch\dfs\Applications\Altium\Datasheets\R0402_Phycomp_RC0402.pdf; Author: CERN DEM JLC; CreateDate: 24/06/2009; LatestRevisionDate: 17/10/2012
R173 R174 = R0402_4K7_1%_0.0625W_100PPM: Resistor - 1%; Part Description: General Purpose Thick Film Chip Resistor; Manufacturer: GENERIC; Manufacturer1 Part Number: 232270674702L; TC: ±100ppm/°C; PressFit: No; Part Number: R0402_4K7_1%_0.0625W_100PPM; Component Kind: Standard; Component Type: Standard; Pin Count: 2; Value: 4k7; Status: Not Recommended; Power: 0.0625W; Tolerance: ±1%; Manufacturer Part Number: R0402_4K7_1%_0.0625W_100PPM; Case: 0402; Mounted: Yes; Sense: No; Socket: No; SMD: Yes; Manufacturer1 Example: YAGEO PHYCOMP; Manufacturer1 ComponentHeight: 0.4mm; HelpURL: \\cern.ch\dfs\Applications\Altium\Datasheets\R0402_Phycomp_RC0402.pdf; Author: CERN DEM JLC; CreateDate: 12/3/2007; LatestRevisionDate: 10/17/2012
R225 = R0402_49R9_1%_0.0625W_100PPM: Resistor - 1%; Part Description: General Purpose Thick Film Chip Resistor; Manufacturer: GENERIC; Manufacturer1 Part Number: 232270674999L or RC0402FR-0749R9L; TC: ±100ppm/°C; PressFit: No; Part Number: R0402_49R9_1%_0.0625W_100PPM; Component Kind: Standard; Component Type: Standard; Pin Count: 2; Value: 49R9; Status: Not Recommended; Power: 0.0625W; Tolerance: ±1%; Manufacturer Part Number: R0402_49R9_1%_0.0625W_100PPM; Case: 0402; Mounted: Yes; Sense: No; Socket: No; SMD: Yes; Manufacturer1 Example: YAGEO PHYCOMP; Manufacturer1 ComponentHeight: 0.4mm; HelpURL: \\cern.ch\dfs\Applications\Altium\Datasheets\R0402_Phycomp_RC0402.pdf; Author: CERN DEM JLC; CreateDate: 24.10.2012; LatestRevisionDate: 24.10.2012
TP20 TP21 = SMD_PAD_D1MM: as TP22-TP24 on sheet DAC; Part Number: SMD_PAD_D1MM; Component Type: Standard (No BOM); Pin Count: 1; Family: SMD Pad; Socket: No; SMD: No; Sense: No; Status: None; ComponentHeight: 0mm; HelpURL: Undefined; Author: CERN DEM JLC; CreateDate: 10-Oct-17; LatestRevisionDate: 10-Oct-17; PackageDescription: 1mm Diameter SMD Pad

## Sheet CON_MEZZANINE_ADC_DAC.SchDoc: Mezzanine con ADC, DAC
size 420 x 297 mm; Author: P. Zdunek; DrawnBy: P. Zdunek; DocumentNumber: 22; SheetNumber: 22; SheetTotal: 37; ModifiedBy: -; CheckedDate: -; Title2: Fast Stabilizer; DivGrp: WUT ISE; Designer: G.Kasprowicz
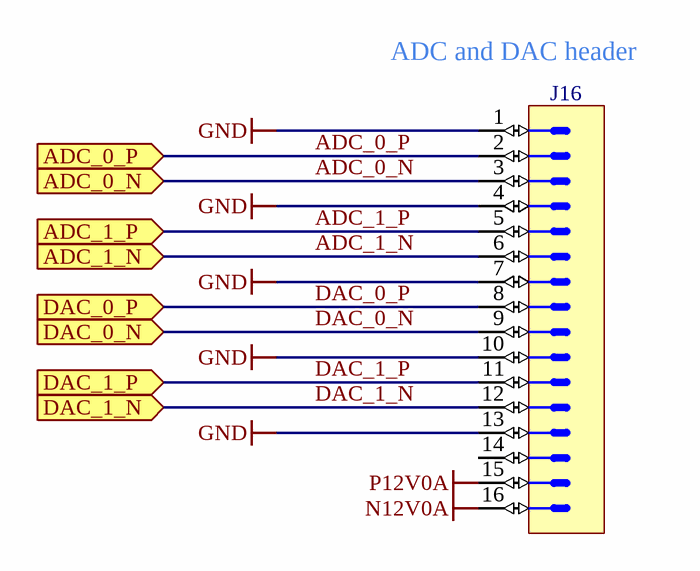
[diagram p17: CON_MEZZANINE_ADC_DAC.SchDoc]

### Parts
J16  Header 16  [3M_N2516-6002RB]  (value not drawn)

### Ports
ADC_0_N (in), ADC_0_P (in), ADC_1_N (in), ADC_1_P (in), DAC_0_N (in), DAC_0_P (in), DAC_1_N (in), DAC_1_P (in)

### Nets
GND: J16.1 J16.4 J16.7 J16.10 J16.13
N12V0A: J16.16
P12V0A: J16.15
ADC_0_N: J16.3 ; port ADC_0_N
ADC_0_P: J16.2 ; port ADC_0_P
ADC_1_N: J16.6 ; port ADC_1_N
ADC_1_P: J16.5 ; port ADC_1_P
DAC_0_N: J16.9 ; port DAC_0_N
DAC_0_P: J16.8 ; port DAC_0_P
DAC_1_N: J16.12 ; port DAC_1_N
DAC_1_P: J16.11 ; port DAC_1_P

Not connected (* = marked no-connect by the designer): J16 14

### Notes on the sheet
- (near J16) ADC and DAC header
- Project/Equipment
- Document
- Designer
- Drawn by
- Check.by
- Copyright WUT ISE 2020.
  This documentation describes Open Hardware and is licensed under the CERN OHL v.1.2. You may redistribute and modify this documentation under the terms of the CERN OHL v.1.2. (http://ohwr.org/CERNOHL). This documentation is distributed WITHOUT ANY EXPRESS OR IMPLIED WARRANTY, INCLUDING OF MERCHANTABILITY, SATISFACTORY QUALITY AND FITNESS FOR A PARTICULAR PURPOSE. Please see the CERN OHL v.1.2 for applicable conditions.
- Contact
- File
- Last Mod.
- Print Date
- Sheet
- Size
- A3
- of
- Rev

### Library data of the parts
J16 = 3M_N2516-6002RB: Connector 16 Male; Part Description: 16 Contacts - Straight .100'' x .100'' Low Profile Four-Wall Header, 2500 Series; Manufacturer: 3M; PressFit: No; Part Number: 3M_N2516-6002RB; Component Kind: Standard; Component Type: Standard; Pin Count: 16; Family: Header 16; Mounted: Yes; Socket: No; SMD: No; Sense: No; Status: None; Manufacturer Part Number: N2516-6002RB; ComponentHeight: 10.03mm; HelpURL: \\cern.ch\dfs\Applications\Altium\Datasheets\3M_N2516-6002RB.pdf; Author: CERN DEM JLC; CreateDate: 11.02.2009; LatestRevisionDate: 11.08.2009

## Sheet CON_ETH.SchDoc: Eth connector, PoE
size 420 x 297 mm; Author: P. Zdunek; CompanyName: WUT ISE; DrawnBy: P. Zdunek; Organization: WUT ISE; Address1: PW ISE; Address2: Nowowiejska 15/19 00-665 Warsaw; Address3: p.zdunek90@gmail.com; DocumentNumber: 18; Revision: 1.0; SheetNumber: 18; SheetTotal: 37; ModifiedBy: -; CheckedDate: -; DivGrp: WUT ISE; Designer: P. Zdunek; Title2: Fast Stabilizer; ModifiedDate: -; ProjectName: Sensor Box
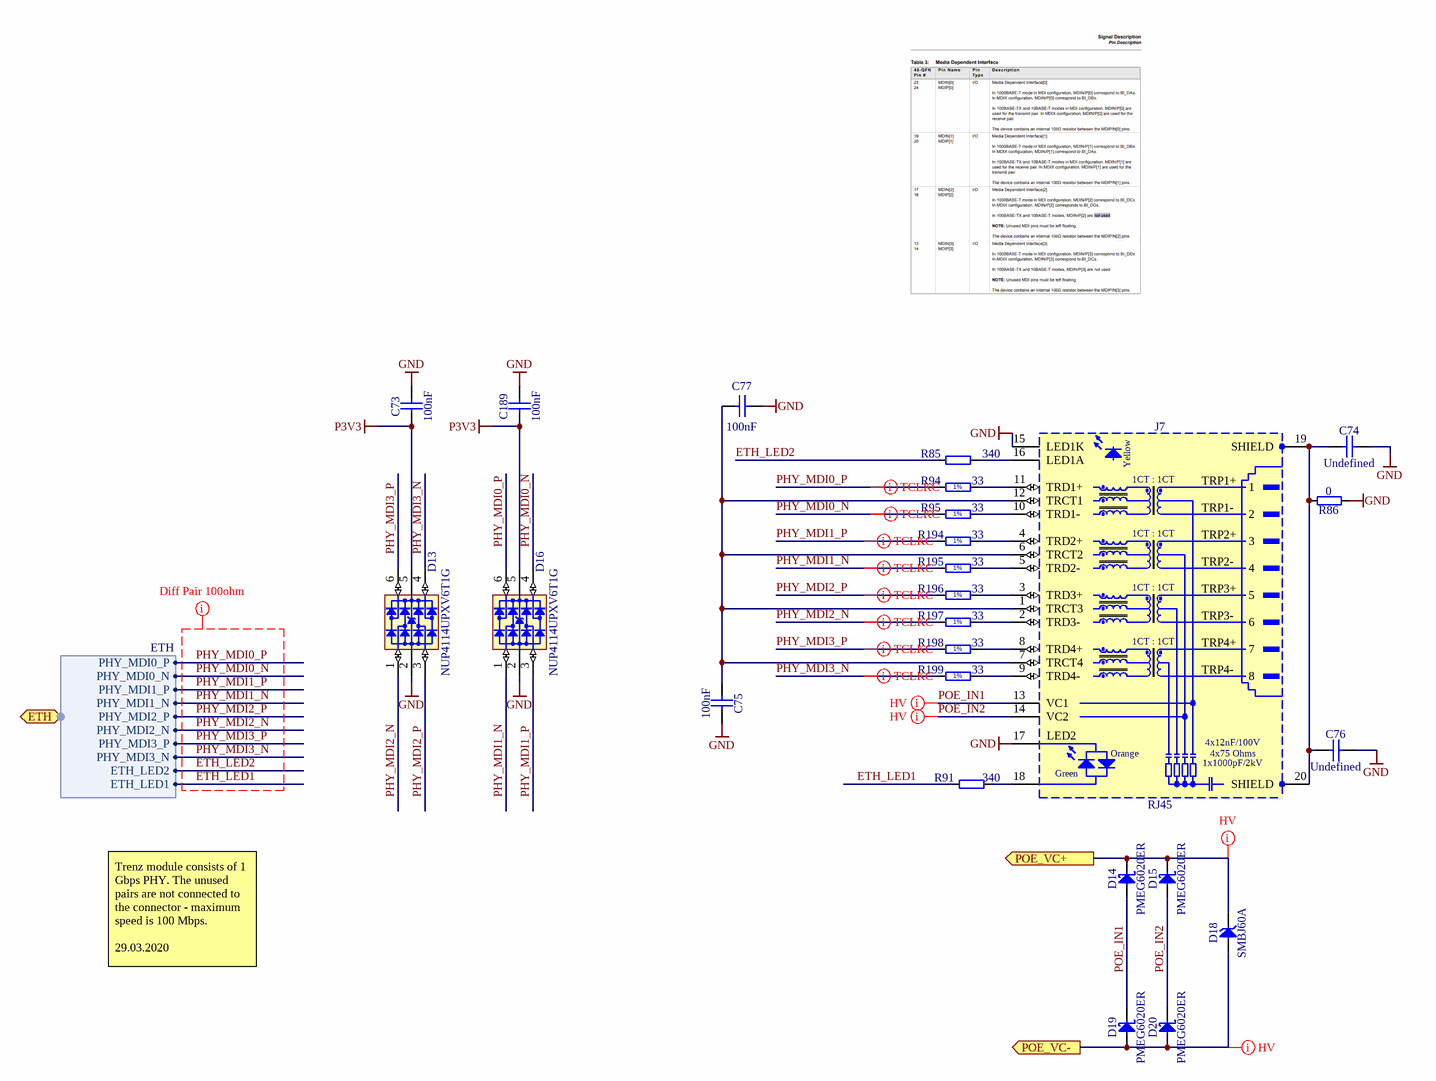
[diagram p18: CON_ETH.SchDoc]

### Parts
C73  100nF  [CAPC1005X55N]
C74  Undefined  [CAPC1608X90N]
C75  100nF  [CAPC1005X55N]
C76  Undefined  [CAPC1608X90N]
C77  100nF  [CAPC1005X55N]
C189  100nF  [CAPC1005X55N]
D13  NUP4114UPXV6T1G  [SOTFL50P160X60-6N]
D14  PMEG6020ER  [SODFL3517X110N]
D15  PMEG6020ER  [SODFL3517X110N]
D16  NUP4114UPXV6T1G  [SOTFL50P160X60-6N]
D18  SMBJ60A  [DIOM5336X265N]
D19  PMEG6020ER  [SODFL3517X110N]
D20  PMEG6020ER  [SODFL3517X110N]
J7  RJ45  [BEL_0826-1X1T-80-F]
R85  340  [RESC1608X55N]
R86  0  [RESC1005X40N]
R91  340  [RESC1608X55N]
R94  33  [RESC1005X40N]
R95  33  [RESC1005X40N]
R194  33  [RESC1005X40N]
R195  33  [RESC1005X40N]
R196  33  [RESC1005X40N]
R197  33  [RESC1005X40N]
R198  33  [RESC1005X40N]
R199  33  [RESC1005X40N]

### Ports
ETH (bidir, harness ETH), POE_VC+ (out), POE_VC- (out)

### Harnesses
ETH: PHY_MDI0_P, PHY_MDI0_N, PHY_MDI1_P, PHY_MDI1_N, PHY_MDI2_P, PHY_MDI2_N, PHY_MDI3_P, PHY_MDI3_N, ETH_LED2, ETH_LED1

### Nets
GND: C73.2 C74.2 C75.1 C76.2 C77.2 C189.2 D13.2(GND) D16.2(GND) J7.15(LED1K) J7.17(LED2) R86.1
P3V3: C73.1 C189.1 D13.5(VBUS) D16.5(VBUS)
ETH_LED1: R91.1 ; port ETH.ETH_LED1
ETH_LED2: R85.1 ; port ETH.ETH_LED2
PHY_MDI0_N: D16.4(I/O3) R95.1 ; port ETH.PHY_MDI0_N
PHY_MDI0_P: D16.6(I/O4) R94.1 ; port ETH.PHY_MDI0_P
PHY_MDI1_N: D16.1(I/O1) R195.1 ; port ETH.PHY_MDI1_N
PHY_MDI1_P: D16.3(I/O2) R194.1 ; port ETH.PHY_MDI1_P
PHY_MDI2_N: D13.1(I/O1) R197.1 ; port ETH.PHY_MDI2_N
PHY_MDI2_P: D13.3(I/O2) R196.1 ; port ETH.PHY_MDI2_P
PHY_MDI3_N: D13.4(I/O3) R199.1 ; port ETH.PHY_MDI3_N
PHY_MDI3_P: D13.6(I/O4) R198.1 ; port ETH.PHY_MDI3_P
POE_IN1: D14.2(A) D19.1(C) J7.13(VC1)
POE_IN2: D15.2(A) D20.1(C) J7.14(VC2)
POE_VC+: D14.1(C) D15.1(C) D18.1(C) ; port POE_VC+
POE_VC-: D18.2(A) D19.2(A) D20.2(A) ; port POE_VC-
NetC74_1: C74.1 C76.1 J7.19(SHIELD) J7.20(SHIELD) R86.2
NetC75_2: C75.2 C77.1 J7.1(TRCT3) J7.6(TRCT2) J7.7(TRCT4) J7.12(TRCT1)
NetJ7_2: J7.2(TRD3-) R197.2
NetJ7_3: J7.3(TRD3+) R196.2
NetJ7_4: J7.4(TRD2+) R194.2
NetJ7_5: J7.5(TRD2-) R195.2
NetJ7_8: J7.8(TRD4+) R198.2
NetJ7_9: J7.9(TRD4-) R199.2
NetJ7_10: J7.10(TRD1-) R95.2
NetJ7_11: J7.11(TRD1+) R94.2
NetJ7_16: J7.16(LED1A) R85.2
NetJ7_18: J7.18(LED2) R91.2

### Layout directives
net class HV: POE_IN1, POE_IN2, POE_VC+, POE_VC-
mark named Diff Pair 100ohm: ETH_LED1, ETH_LED2, PHY_MDI0_N, PHY_MDI0_P, PHY_MDI1_N, PHY_MDI1_P, PHY_MDI2_N, PHY_MDI2_P, PHY_MDI3_N, PHY_MDI3_P
differential pair: PHY_MDI0_N, PHY_MDI0_P, PHY_MDI1_N, PHY_MDI1_P, PHY_MDI2_N, PHY_MDI2_P, PHY_MDI3_N, PHY_MDI3_P

### Notes on the sheet
- Trenz module consists of 1 Gbps PHY. The unused pairs are not connected to the connector - maximum speed is 100 Mbps.
  29.03.2020
- Project/Equipment
- Document
- Designer
- Drawn by
- Check.by
- Copyright WUT ISE 2020.
  This documentation describes Open Hardware and is licensed under the CERN OHL v.1.2. You may redistribute and modify this documentation under the terms of the CERN OHL v.1.2. (http://ohwr.org/CERNOHL). This documentation is distributed WITHOUT ANY EXPRESS OR IMPLIED WARRANTY, INCLUDING OF MERCHANTABILITY, SATISFACTORY QUALITY AND FITNESS FOR A PARTICULAR PURPOSE. Please see the CERN OHL v.1.2 for applicable conditions.
- Contact
- File
- Last Mod.
- Print Date
- Sheet
- Size
- A3
- of
- Rev
- (in symbol BELFUSE_0826-1X1T-80-F) Yellow; 1CT : 1CT; TRP1+; TRP1-; TRP2+; TRP2-; TRP3+; TRP3-; TRP4+; TRP4-; 4x12nF/100V; Orange; 4x75 Ohms; 1x1000pF/2kV; Green
- (in symbol R0402_33R_1%_0.0625W_100PPM) 1%

### Library data of the parts
C73 C75 C77 C189 = CC0402_100NF_16V_10%_X5R: as C158 on sheet CLK_GEN; Part Number: CC0402_100NF_16V_10%_X5R; Component Kind: Standard; Component Type: Standard; Pin Count: 2; Value: 100nF; Status: None; Manufacturer Part Number: CC0402_100NF_16V_10%_X5R; Case: 0402; Mounted: Yes; Socket: No; SMD: Yes; Manufacturer1 Example: MURATA; Manufacturer1 ComponentHeight: 0.55mm; HelpURL: \\cern.ch\dfs\Applications\Altium\Datasheets\CC0402_X5R_MURATA_GRM.pdf; Author: CERN DEM JLC; Sense: No
  C73 C75 C189: CreateDate: 10.12.2013; LatestRevisionDate: 10.12.2013
  C77: CreateDate: 10/12/2013; LatestRevisionDate: 10/12/2013
C74 C76 = CC0603_NO-VALUE: Non-polarised capacitor; Part Description: Reserved Footprint For 0603(1608) Chip Ceramic Capacitor; Mounted: No; Part Number: CC0603_NO-VALUE; Component Kind: Standard; Component Type: Standard; Pin Count: 2; Value: Undefined; Status: None; Manufacturer: Undefined; Manufacturer Part Number: CC0603_NO-VALUE; Case: 0603; Socket: No; SMD: Yes; Sense: No; Manufacturer1 ComponentHeight: 0.9mm; HelpURL: Undefined; Author: CERN DEM MR; CreateDate: 22.11.2016; LatestRevisionDate: 22.11.2016
D13 D16 = NUP4114UPXV6T1G: Part Description: ESD Protection Diodes Array (8kV) with Low Clamping Voltage; Manufacturer: ON SEMICONDUCTOR; Voltage: 5.5V; PressFit: No; Bonding: No; Part Number: NUP4114UPXV6T1G; Component Kind: Standard; Component Type: Standard; Device: NUP4114UPXV6T1G; PackageDescription: SOTFL (SOT666, SOT563,), 0.50mm, Pitch; 6 Pin, 1.20mm W X 1.60mm L X 0.60mm H Body, IPC Medium Density; Manufacturer Part Number: NUP4114UPXV6T1G; Pin Count: 8; Mounted: Yes; Socket: No; SMD: Yes; Sense: No; ComponentHeight: 1.75mm; HelpURL: \\cern.ch\dfs\Applications\Altium\Datasheets\NUP4114UPXV6T1G.pdf; Author: CERN DEM JLC; CreateDate: 05.12.2012; LatestRevisionDate: 05.12.2012
D14 D15 D19 D20 = PMEG6020ER: Schottky Diode; Part Description: MEGA Schottky Barrier Rectifier; Manufacturer: NXP SEMICONDUCTORS; Voltage: 60V; Power: 2A; PressFit: No; Bonding: No; Part Number: PMEG6020ER; Component Kind: Standard; Component Type: Standard; Device: PMEG6020ER; PackageDescription: SODFL Diode (SOD123W); 2.60mm W X 1.70mm L X 1.10mm H body, IPC Medium Density; Manufacturer Part Number: PMEG6020ER; Pin Count: 2; Case: SOD-123FL; Mounted: Yes; Socket: No; SMD: Yes; Sense: No; ComponentHeight: 1.1mm; HelpURL: \\cern.ch\dfs\Applications\Altium\Datasheets\PMEG6020ER.pdf; Author: CERN DEM JMW; CreateDate: 19.06.2014; LatestRevisionDate: 19.06.2014
D18 = SMBJ60A: Zener Diode; Part Description: Uni-Directional Transient Voltage Suppressor Diode; Manufacturer: FAIRCHILD SEMICONDUCTOR; Voltage: 60V; Power: 600W; PressFit: No; Bonding: No; Part Number: SMBJ60A; Component Kind: Standard; Component Type: Standard; Device: SMBJ60A; PackageDescription: DO-214-AA/SMB Diode, Molded Body; 5.34mm L X 3.625mm W X 2.65mm H, IPC Medium Density; Manufacturer Part Number: SMBJ60A; Pin Count: 2; Case: DO-214AA; Mounted: Yes; Socket: No; SMD: Yes; Sense: No; ComponentHeight: 2.65mm; HelpURL: \\cern.ch\dfs\Applications\Altium\Datasheets\SMBJ.pdf; Author: CERN DEM JLC; CreateDate: 30.06.2008; LatestRevisionDate: 19.12.2011
J7 = BELFUSE_0826-1X1T-80-F: MagJack 1000BaseT, PoE+, 1X1, OG/Y, Tab Up, RoHS; Part Description: 1 Port, Orange Green/Yellow LEDs, RJ45 1000BaseT, PoE, Gigabit MagJack® Connector Module; Manufacturer: BEL MAGNETIC SOLUTIONS; PressFit: No; Part Number: BELFUSE_0826-1X1T-80-F; Component Kind: Standard; Component Type: Standard; Pin Count: 20; Family: RJ45; Mounted: Yes; Socket: No; SMD: No; Sense: No; Status: None; Manufacturer Part Number: 0826-1X1T-80-F; ComponentHeight: 13.61mm; HelpURL: \\cern.ch\dfs\Applications\Altium\Datasheets\BEL_0826-1X1T-80-F.pdf; Author: CERN DEM JLC; CreateDate: 30.04.2014; LatestRevisionDate: 20.09.2018
R85 R91 = R0603_340R_0.1%_0.063W_10PPM: Resistor - 0.1%; Part Description: Thin Film Chip Resistor; Manufacturer: GENERIC; Manufacturer1 Part Number: RN73C1J340RBTDF; Power: 0.063W; TC: ±10ppm; PressFit: No; Part Number: R0603_340R_0.1%_0.063W_10PPM; Component Kind: Standard; Component Type: Standard; Pin Count: 2; Value: 340; Status: Not Recommended; Tolerance: ±0.1%; Manufacturer Part Number: R0603_340R_0.1%_0.063W_10PPM; Case: 0603; Mounted: Yes; Sense: No; Socket: No; SMD: Yes; Manufacturer1 Example: TYCO HOLSWORTHY; Manufacturer1 ComponentHeight: 0.5mm; HelpURL: \\cern.ch\dfs\Applications\Altium\Datasheets\R0603_Tyco_RN73.pdf; Author: CERN DEM JLC; CreateDate: 03.12.2007; LatestRevisionDate: 13.03.2008
R86 = R0402_0R_JUMPER: Resistor; Part Description: 1A (0.05R Max DC Resistance) Zero Ohm Jumper; Manufacturer: GENERIC; Manufacturer1 Part Number: 232270591001L; PressFit: No; Part Number: R0402_0R_JUMPER; Component Kind: Standard; Component Type: Standard; Pin Count: 2; Value: 0; Status: Not Recommended; Manufacturer Part Number: R0402_0R_JUMPER; Case: 0402; Mounted: Yes; Sense: No; Socket: No; SMD: Yes; Manufacturer1 Example: YAGEO PHYCOMP; Manufacturer1 ComponentHeight: 0.4mm; HelpURL: \\cern.ch\dfs\Applications\Altium\Datasheets\R0402_Phycomp_RC0402.pdf; Author: CERN DEM JLC; CreateDate: 03/12/2007; LatestRevisionDate: 17/10/2012
R94 R95 R194-R199 = R0402_33R_1%_0.0625W_100PPM: Resistor - 1%; Part Description: General Purpose Thick Film Chip Resistor; Manufacturer: GENERIC; Manufacturer1 Part Number: 232270673309L; TC: ±100ppm/°C; PressFit: No; Part Number: R0402_33R_1%_0.0625W_100PPM; Component Kind: Standard; Component Type: Standard; Pin Count: 2; Value: 33; Status: Not Recommended; Power: 0.0625W; Tolerance: ±1%; Manufacturer Part Number: R0402_33R_1%_0.0625W_100PPM; Case: 0402; Mounted: Yes; Sense: No; Socket: No; SMD: Yes; Manufacturer1 Example: YAGEO PHYCOMP; Manufacturer1 ComponentHeight: 0.4mm; HelpURL: \\cern.ch\dfs\Applications\Altium\Datasheets\R0402_Phycomp_RC0402.pdf; Author: CERN DEM JLC; CreateDate: 03/12/2007; LatestRevisionDate: 17/10/2012

## Sheet POWER_SUPPLY.SchDoc: Power supplies
size 420 x 297 mm; EDA_Number: ARTIQ; Projet: Stabilizer; Author: P. Zdunek; CompanyName: WUT ISE; DrawnBy: G.Kasprowicz; Organization: WUT ISE; Address1: PW ISE; Address2: Nowowiejska 15/19 00-665 Warsaw; Address3: gkasprow@gmail.com; DocumentNumber: 24; Revision: 1.0; SheetNumber: 24; SheetTotal: 37; ModifiedBy: -; CheckedDate: -; DivGrp: WUT ISE; Designer: G.Kasprowicz; Title2: Fast Stabilizer; ModifiedDate: -; ProjectName: Sensor Box
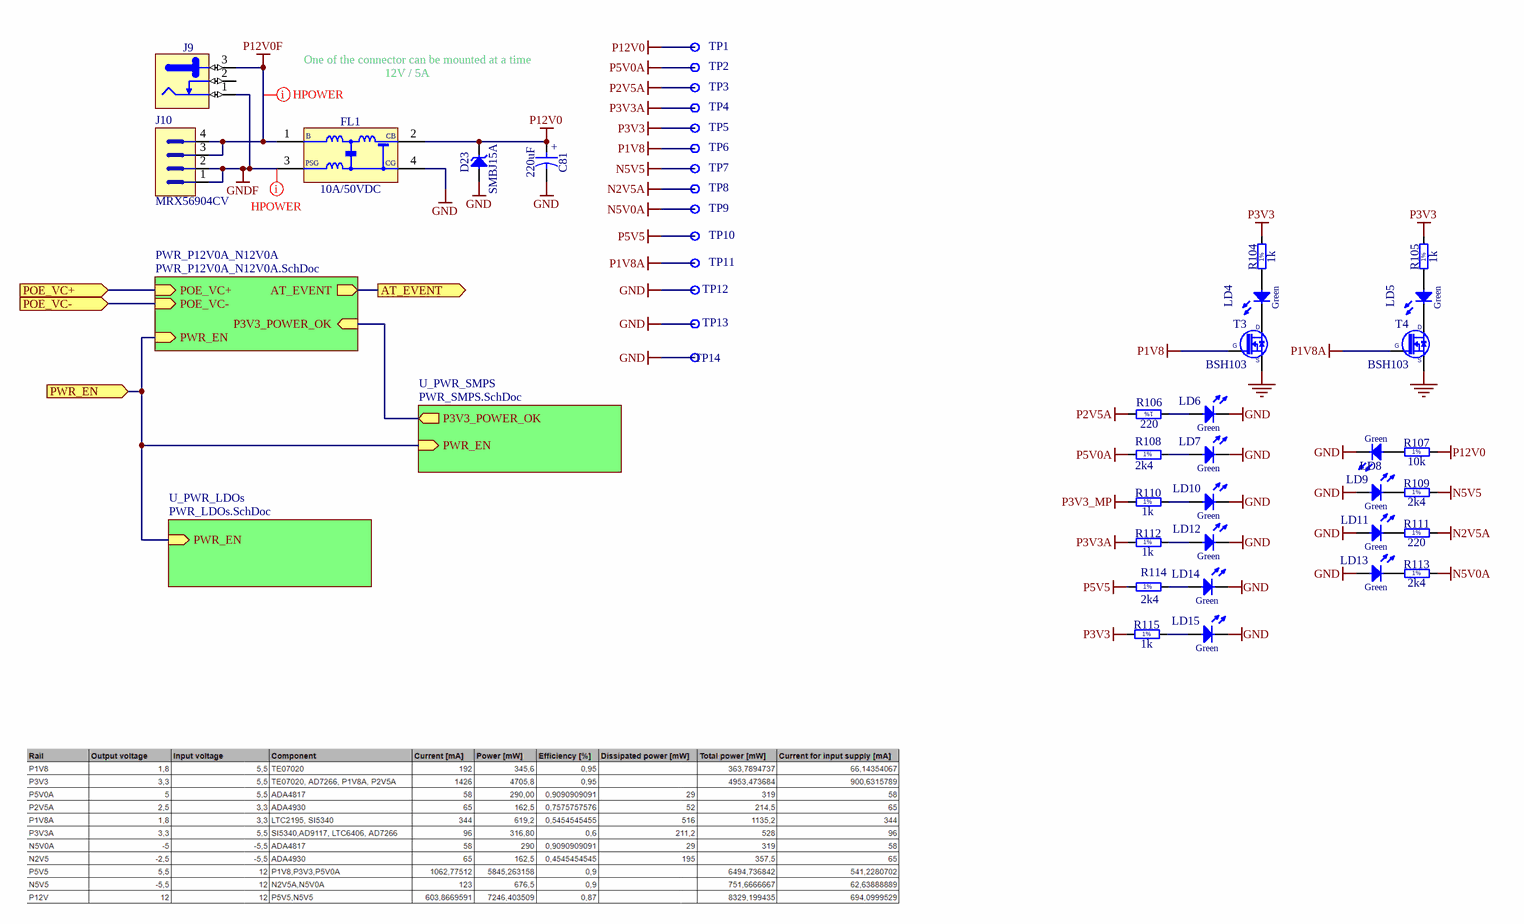
[diagram p19: POWER_SUPPLY.SchDoc]

### Parts
C81  220uF  [CAPAE830X620N]
D23  SMBJ15A  [DIOM5336X265N]
FL1  10A/50VDC  [FIL_MURATA_BNX02]
J9  Jack  [SWITCHCRAFT_L712RA]  (value not drawn)
J10  MRX56904CV  [MRX56904CV]
LD4  Green  [LED_KINGBRIGHT_KPH-1608CGCK]
LD5  Green  [LED_KINGBRIGHT_KPH-1608CGCK]
LD6  Green  [LED_KINGBRIGHT_KPH-1608CGCK]
LD7  Green  [LED_KINGBRIGHT_KPH-1608CGCK]
LD8  Green  [LED_KINGBRIGHT_KPH-1608CGCK]
LD9  Green  [LED_KINGBRIGHT_KPH-1608CGCK]
LD10  Green  [LED_KINGBRIGHT_KPH-1608CGCK]
LD11  Green  [LED_KINGBRIGHT_KPH-1608CGCK]
LD12  Green  [LED_KINGBRIGHT_KPH-1608CGCK]
LD13  Green  [LED_KINGBRIGHT_KPH-1608CGCK]
LD14  Green  [LED_KINGBRIGHT_KPH-1608CGCK]
LD15  Green  [LED_KINGBRIGHT_KPH-1608CGCK]
R104  1k  [RESC1005X40N]
R105  1k  [RESC1005X40N]
R106  220  [RESC1608X55N]
R107  10k  [RESC1005X40N]
R108  2k4  [RESC1005X40N]
R109  2k4  [RESC1005X40N]
R110  1k  [RESC1005X40N]
R111  220  [RESC1608X55N]
R112  1k  [RESC1005X40N]
R113  2k4  [RESC1005X40N]
R114  2k4  [RESC1005X40N]
R115  1k  [RESC1005X40N]
T3  BSH103  [SOT95P230X110-3N]
T4  BSH103  [SOT95P230X110-3N]
TP1  Test Point  [TPS127]  (value not drawn)  (no BOM)
TP2  Test Point  [TPS127]  (value not drawn)  (no BOM)
TP3  Test Point  [TPS127]  (value not drawn)  (no BOM)
TP4  Test Point  [TPS127]  (value not drawn)  (no BOM)
TP5  Test Point  [TPS127]  (value not drawn)  (no BOM)
TP6  Test Point  [TPS127]  (value not drawn)  (no BOM)
TP7  Test Point  [TPS127]  (value not drawn)  (no BOM)
TP8  Test Point  [TPS127]  (value not drawn)  (no BOM)
TP9  Test Point  [TPS127]  (value not drawn)  (no BOM)
TP10  Test Point  [TPS127]  (value not drawn)  (no BOM)
TP11  Test Point  [TPS127]  (value not drawn)  (no BOM)
TP12  Test Point  [TPS127]  (value not drawn)  (no BOM)
TP13  Test Point  [TPS127]  (value not drawn)  (no BOM)
TP14  Plated Hole  [c150h100]  (value not drawn)  (no BOM)

### Sub-sheets
PWR_P12V0A_N12V0A = PWR_P12V0A_N12V0A.SchDoc: POE_VC+ (in), POE_VC- (in), AT_EVENT (out), P3V3_POWER_OK (in), PWR_EN (in)
U_PWR_LDOs = PWR_LDOs.SchDoc: PWR_EN (in)
U_PWR_SMPS = PWR_SMPS.SchDoc: P3V3_POWER_OK (out), PWR_EN (in)

### Ports
AT_EVENT (out), POE_VC+ (in), POE_VC- (in), PWR_EN (in)

### Nets
GND: C81.2 D23.2(A) FL1.4(CG) LD6.1(C) LD7.1(C) LD8.1(C) LD9.2(A) LD10.1(C) LD11.2(A) LD12.1(C) LD13.2(A) LD14.1(C) LD15.1(C) T3.2(S) T4.2(S) TP12.1 TP13.1 TP14.1
GNDF: FL1.3(PSG) J9.1 J10.1 J10.2
N2V5A: R111.2 TP8.1
N5V0A: R113.2 TP9.1
N5V5: R109.2 TP7.1
P1V8: T3.1(G) TP6.1
P1V8A: T4.1(G) TP11.1
P2V5A: R106.2 TP3.1
P3V3: R104.2 R105.2 R115.1 TP5.1
P3V3_MP: R110.1
P3V3A: R112.1 TP4.1
P5V0A: R108.1 TP2.1
P5V5: R114.1 TP10.1
P12V0: C81.1 D23.1(C) FL1.2(CB) R107.2 TP1.1
P12V0F: FL1.1(B) J9.3 J10.3 J10.4
AT_EVENT: port AT_EVENT, sheet PWR_P12V0A_N12V0A/AT_EVENT
P3V3_POWER_OK: sheet U_PWR_SMPS/P3V3_POWER_OK, sheet PWR_P12V0A_N12V0A/P3V3_POWER_OK
POE_VC+: port POE_VC+, sheet PWR_P12V0A_N12V0A/POE_VC+
POE_VC-: port POE_VC-, sheet PWR_P12V0A_N12V0A/POE_VC-
PWR_EN: port PWR_EN, sheet U_PWR_SMPS/PWR_EN, sheet PWR_P12V0A_N12V0A/PWR_EN, sheet U_PWR_LDOs/PWR_EN
NetLD4_1: LD4.1(C) T3.3(D)
NetLD4_2: LD4.2(A) R104.1
NetLD5_1: LD5.1(C) T4.3(D)
NetLD5_2: LD5.2(A) R105.1
NetLD6_2: LD6.2(A) R106.1
NetLD7_2: LD7.2(A) R108.2
NetLD8_2: LD8.2(A) R107.1
NetLD9_1: LD9.1(C) R109.1
NetLD10_2: LD10.2(A) R110.2
NetLD11_1: LD11.1(C) R111.1
NetLD12_2: LD12.2(A) R112.2
NetLD13_1: LD13.1(C) R113.1
NetLD14_2: LD14.2(A) R114.2
NetLD15_2: LD15.2(A) R115.2

Not connected (* = marked no-connect by the designer): J9 2

### Layout directives
net class Hpower; rule Routing Via Style [Pref Size = 0.7mm    Pref Hole Size = 0.5mm]; rule Width Constraint [Pref Width = 20mil    Min Width = 15mil    Max Width = 50mil]: GNDF, P12V0F

### Notes on the sheet
- One of the connector can be mounted at a time
- 12V / 5A
- Project/Equipment
- Document
- Designer
- Drawn by
- Check.by
- Copyright WUT ISE 2020.
  This documentation describes Open Hardware and is licensed under the CERN OHL v.1.2. You may redistribute and modify this documentation under the terms of the CERN OHL v.1.2. (http://ohwr.org/CERNOHL). This documentation is distributed WITHOUT ANY EXPRESS OR IMPLIED WARRANTY, INCLUDING OF MERCHANTABILITY, SATISFACTORY QUALITY AND FITNESS FOR A PARTICULAR PURPOSE. Please see the CERN OHL v.1.2 for applicable conditions.
- Contact
- File
- Last Mod.
- Print Date
- Sheet
- Size
- A3
- of
- Rev
- (in symbol CAE830-620_220UF_16V_20%) +
- (in symbol R0402_1K_1%_0.0625W_100PPM) 1%
- (in symbol R0402_1k_1%_0.0625W_100PPM) 1%
- (in symbol R0402_2K4_1%_0.0625W_100PPM) 1%
- (in symbol R0402_10K_1%_0.0625W_100PPM) 1%
- (in symbol R0603_220R_1%_0.1W_100PPM) 1%

### Library data of the parts
C81 = CAE830-620_220UF_16V_20%: Polarised capacitor; Part Description: Aluminum Electrolytic SMT Capacitor; Manufacturer: PANASONIC; Manufacturer Part Number: EEEFK1C221AP; Voltage: 16V; Tolerance: ±20%; Part Number: CAE830-620_220UF_16V_20%; Component Kind: Standard; Component Type: Standard; Pin Count: 2; Value: 220uF; Status: Not Recommended; Case: E; Mounted: Yes; Socket: No; SMD: Yes; Sense: No; ComponentHeight: 6.2mm; HelpURL: \\cern.ch\dfs\Applications\Altium\Datasheets\CAE_PANASONIC_FK.pdf; Author: CERN DEM JLC; CreateDate: 03.12.2007; LatestRevisionDate: 05.11.2014
D23 = SMBJ15A: Zener Diode; Part Description: Uni-Directional Transient Voltage Suppressor Diode; Manufacturer: FAIRCHILD SEMICONDUCTOR; Voltage: 15V; Power: 600W; PressFit: No; Bonding: No; Part Number: SMBJ15A; Component Kind: Standard; Component Type: Standard; Device: SMBJ15A; PackageDescription: DO-214-AA/SMB Diode, Molded Body; 5.34mm L X 3.625mm W X 2.65mm H, IPC Medium Density; Manufacturer Part Number: SMBJ15A; Pin Count: 2; Case: DO-214AA; Mounted: Yes; Socket: No; SMD: Yes; Sense: No; ComponentHeight: 2.65mm; HelpURL: \\cern.ch\dfs\Applications\Altium\Datasheets\SMBJ.pdf; Author: CERN DEM JLC; CreateDate: 08.12.2008; LatestRevisionDate: 19.12.2011
FL1 = FIL_MURATA_BNX022-01L: Block Type EMIFIL (LC Combined); Part Description: Block Type EMIFIL (LC Combined) SMD Type, BNX02* Series; Manufacturer: MURATA; Resistance: 0.5R; Part Number: FIL_MURATA_BNX022-01L; Component Kind: Standard; Component Type: Standard; Pin Count: 2; Value: 10A/50VDC; Status: None; Manufacturer Part Number: BNX022-01L; Mounted: Yes; Socket: No; SMD: Yes; Sense: No; ComponentHeight: 3.3mm; HelpURL: \\cern.ch\dfs\Applications\Altium\Datasheets\FIL_MURATA_BNX022-01L.pdf; Author: CERN DEM JLC; CreateDate: 10.10.2012; LatestRevisionDate: 10.10.2012
J9 = CON_DC_5A_THT_RA: 24V /3. 5A, 2.1mm Diameter Pin, SMD DC Power Supply Connector With  Break Contact; Part Description: 12V/5A, 2.5mm Diameter Pin, THT DC Power Supply Connector With  Break Contact; Manufacturer: SWITCHCRAFT; Manufacturer Part Number: L712RA; PressFit: No; Part Number: SWITCHCRAFT_L712RA; Component Kind: Standard; Component Type: Standard; Pin Count: 3; Family: Jack; Mounted: Yes; Socket: No; SMD: No; Sense: No; Status: None; ComponentHeight: 11mm; HelpURL: \\cern.ch\dfs\Applications\Altium\Datasheets\LUMBERG_161314.pdf; Author: GK; CreateDate: 15.02.2011; LatestRevisionDate: 20.07.2011
J10 = CON_CRIMP_4.2mm_RA_4: 4.2mm cripm terminal header
LD4-LD15 = LED_KINGBRIGHT_KPH-1608CGCK: LED Green 1C 2A; Part Description: SMD Green LED, Case 1.6mmX0.8mm(0603), 0.65mm Thickness; PressFit: No; Bonding: No; Manufacturer Part Number: KPH-1608CGCK; ComponentHeight: 0.65mm; HelpURL: \\cern.ch\dfs\Applications\Altium\Datasheets\LED_KINGBRIGHT_KPH-1608CGCK.pdf; Part Number: LED_KINGBRIGHT_KPH-1608CGCK; Component Kind: Standard; Component Type: Standard; Color: Green; PackageDescription: SMT Green LED, Case 0603, Body L 1.6 x W 0.8mm H 0.65mm; Manufacturer: KINGBRIGHT; Pin Count: 2; Mounted: Yes; Socket: No; SMD: Yes; Sense: No; Author: CERN DEM JLC
  LD4 LD5: CreateDate: 03-Jul-17; LatestRevisionDate: 03-Jul-17
  LD6-LD15: CreateDate: 03/07/2017; LatestRevisionDate: 03/07/2017
R104 R105 = R0402_1k_1%_0.0625W_100PPM: Resistor - 1%; Part Description: General Purpose Thick Film Chip Resistor; Manufacturer: GENERIC; Manufacturer1 Part Number: 232270671002L; TC: ±100ppm/°C; PressFit: No; Part Number: R0402_1K_1%_0.0625W_100PPM; Component Kind: Standard; Component Type: Standard; Pin Count: 2; Value: 1k; Status: Not Recommended; Power: 0.0625W; Tolerance: ±1%; Manufacturer Part Number: R0402_1K_1%_0.0625W_100PPM; Case: 0402; Mounted: Yes; Sense: No; Socket: No; SMD: Yes; Manufacturer1 Example: YAGEO PHYCOMP; Manufacturer1 ComponentHeight: 0.4mm; HelpURL: \\cern.ch\dfs\Applications\Altium\Datasheets\R0402_Phycomp_RC0402.pdf; Author: CERN DEM JLC; CreateDate: 03.12.2007; LatestRevisionDate: 17.10.2012; ClassName: Artix
R106 R111 = R0603_220R_1%_0.1W_100PPM: Resistor - 1%; Part Description: General Purpose Thick Film Chip Resistor; Manufacturer: GENERIC; Manufacturer1 Part Number: NRC06F2200TRF; Power: 0.1W; TC: ±100ppm/°C; Part Number: R0603_220R_1%_0.1W_100PPM; Component Kind: Standard; Component Type: Standard; Pin Count: 2; Value: 220; Status: Preferred; Tolerance: ±1%; Manufacturer Part Number: R0603_220R_1%_0.1W_100PPM; Case: 0603; Mounted: Yes; Sense: No; Socket: No; SMD: Yes; Manufacturer1 Example: NIC COMPONENT; Manufacturer1 ComponentHeight: 0.55mm; HelpURL: \\cern.ch\dfs\Applications\Altium\Datasheets\R0603_NIC_NRC.pdf; Author: CERN DEM JLC; CreateDate: 03.12.2007; LatestRevisionDate: 13.03.2008
R107 = R0402_10K_1%_0.0625W_100PPM: Resistor - 1%; Part Description: General Purpose Thick Film Chip Resistor; Manufacturer: GENERIC; Manufacturer1 Part Number: 232270671003L; TC: ±100ppm/°C; PressFit: No; Part Number: R0402_10K_1%_0.0625W_100PPM; Component Kind: Standard; Component Type: Standard; Pin Count: 2; Value: 10k; Status: Not Recommended; Power: 0.0625W; Tolerance: ±1%; Manufacturer Part Number: R0402_10K_1%_0.0625W_100PPM; Case: 0402; Mounted: Yes; Sense: No; Socket: No; SMD: Yes; Manufacturer1 Example: YAGEO PHYCOMP; Manufacturer1 ComponentHeight: 0.4mm; HelpURL: \\cern.ch\dfs\Applications\Altium\Datasheets\R0402_Phycomp_RC0402.pdf; Author: CERN DEM JLC; CreateDate: 03.12.2007; LatestRevisionDate: 17.10.2012
R108 R109 R113 R114 = R0402_2K4_1%_0.0625W_100PPM: Resistor - 1%; Part Description: General Purpose Thick Film Chip Resistor; Manufacturer: GENERIC; Manufacturer1 Part Number: 232270672402L; TC: ±100ppm/°C; PressFit: No; Part Number: R0402_2K4_1%_0.0625W_100PPM; Component Kind: Standard; Component Type: Standard; Pin Count: 2; Value: 2k4; Status: Not Recommended; Power: 0.0625W; Tolerance: ±1%; Manufacturer Part Number: R0402_2K4_1%_0.0625W_100PPM; Case: 0402; Mounted: Yes; Sense: No; Socket: No; SMD: Yes; Manufacturer1 Example: YAGEO PHYCOMP; Manufacturer1 ComponentHeight: 0.4mm; HelpURL: \\cern.ch\dfs\Applications\Altium\Datasheets\R0402_Phycomp_RC0402.pdf; Author: CERN DEM JLC
  R108 R114: CreateDate: 03.12.2007; LatestRevisionDate: 17.10.2012
  R109 R113: CreateDate: 03-Dec-07; LatestRevisionDate: 17-Oct-12
R110 R112 R115 = R0402_1K_1%_0.0625W_100PPM: Resistor - 1%; Part Description: General Purpose Thick Film Chip Resistor; Manufacturer: GENERIC; Manufacturer1 Part Number: 232270671002L; TC: ±100ppm/°C; PressFit: No; Part Number: R0402_1K_1%_0.0625W_100PPM; Component Kind: Standard; Component Type: Standard; Pin Count: 2; Value: 1k; Status: Not Recommended; Power: 0.0625W; Tolerance: ±1%; Manufacturer Part Number: R0402_1K_1%_0.0625W_100PPM; Case: 0402; Mounted: Yes; Sense: No; Socket: No; SMD: Yes; Manufacturer1 Example: YAGEO PHYCOMP; Manufacturer1 ComponentHeight: 0.4mm; HelpURL: \\cern.ch\dfs\Applications\Altium\Datasheets\R0402_Phycomp_RC0402.pdf; Author: CERN DEM JLC; CreateDate: 03.12.2007; LatestRevisionDate: 17.10.2012
T3 T4 = BSH103: N-CHANNEL MOSFET WITH DIODE; Part Description: 30V 850mA N-Channel Enhancement Mode Field-Effect Transistor; Manufacturer: NEXPERIA; PressFit: No; Bonding: No; Part Number: BSH103; Component Kind: Standard; Component Type: Standard; Device: BSH103; PackageDescription: SOT23, 3 pin, Pitch 0.95mm - 1.3mm W X 2.9mm L X 1.1mm H, IPC Medium Density; Manufacturer Part Number: BSH103; Pin Count: 3; Case: SOT23-3; Mounted: Yes; Socket: No; SMD: Yes; Sense: No; ComponentHeight: 1.1mm; HelpURL: \\cern.ch\dfs\Applications\Altium\Datasheets\BSH103.pdf; Author: CERN DEM JLC; CreateDate: 16.03.2010; LatestRevisionDate: 20.06.2017; ClassName: Artix
TP1-TP13 = SMD_PAD_1.27X1.27MM: Part Description: 1.27mm x 1.27mm PCB Copper Area (SMD Test Point); Mounted: No; Part Number: SMD_PAD_1.27X1.27MM; Component Type: Standard (No BOM); Pin Count: 1; Family: Test Point; Socket: No; SMD: Yes; Sense: No; Status: None; ComponentHeight: 0mm; HelpURL: Undefined; Author: CERN DEM JLC; CreateDate: 12.01.2008; LatestRevisionDate: 12.01.2008; PackageDescription: 1.27mm x 1.27mm PCB Copper Area (SMD Test Point)
TP14 = PLATED_HOLE1.0_PAD1.5: Single Terminal Socket; Part Description: Plated Through Hole: Hole Dia.=1mm Pad Dia.=1.5mm,  IPC-7251 Level C; Mounted: No; Part Number: PLATED_HOLE1.0_PAD1.5; Component Type: Standard (No BOM); Pin Count: 1; Family: Plated Hole; Socket: No; SMD: No; Sense: No; Status: None; ComponentHeight: 0mm; HelpURL: Undefined; Author: CERN DEM JLC; CreateDate: 30/10/2008; LatestRevisionDate: 30/10/2008; PackageDescription: Plated Through Hole: Hole Dia.=1mm Pad Dia.=1.5mm,  IPC-7251 Level C